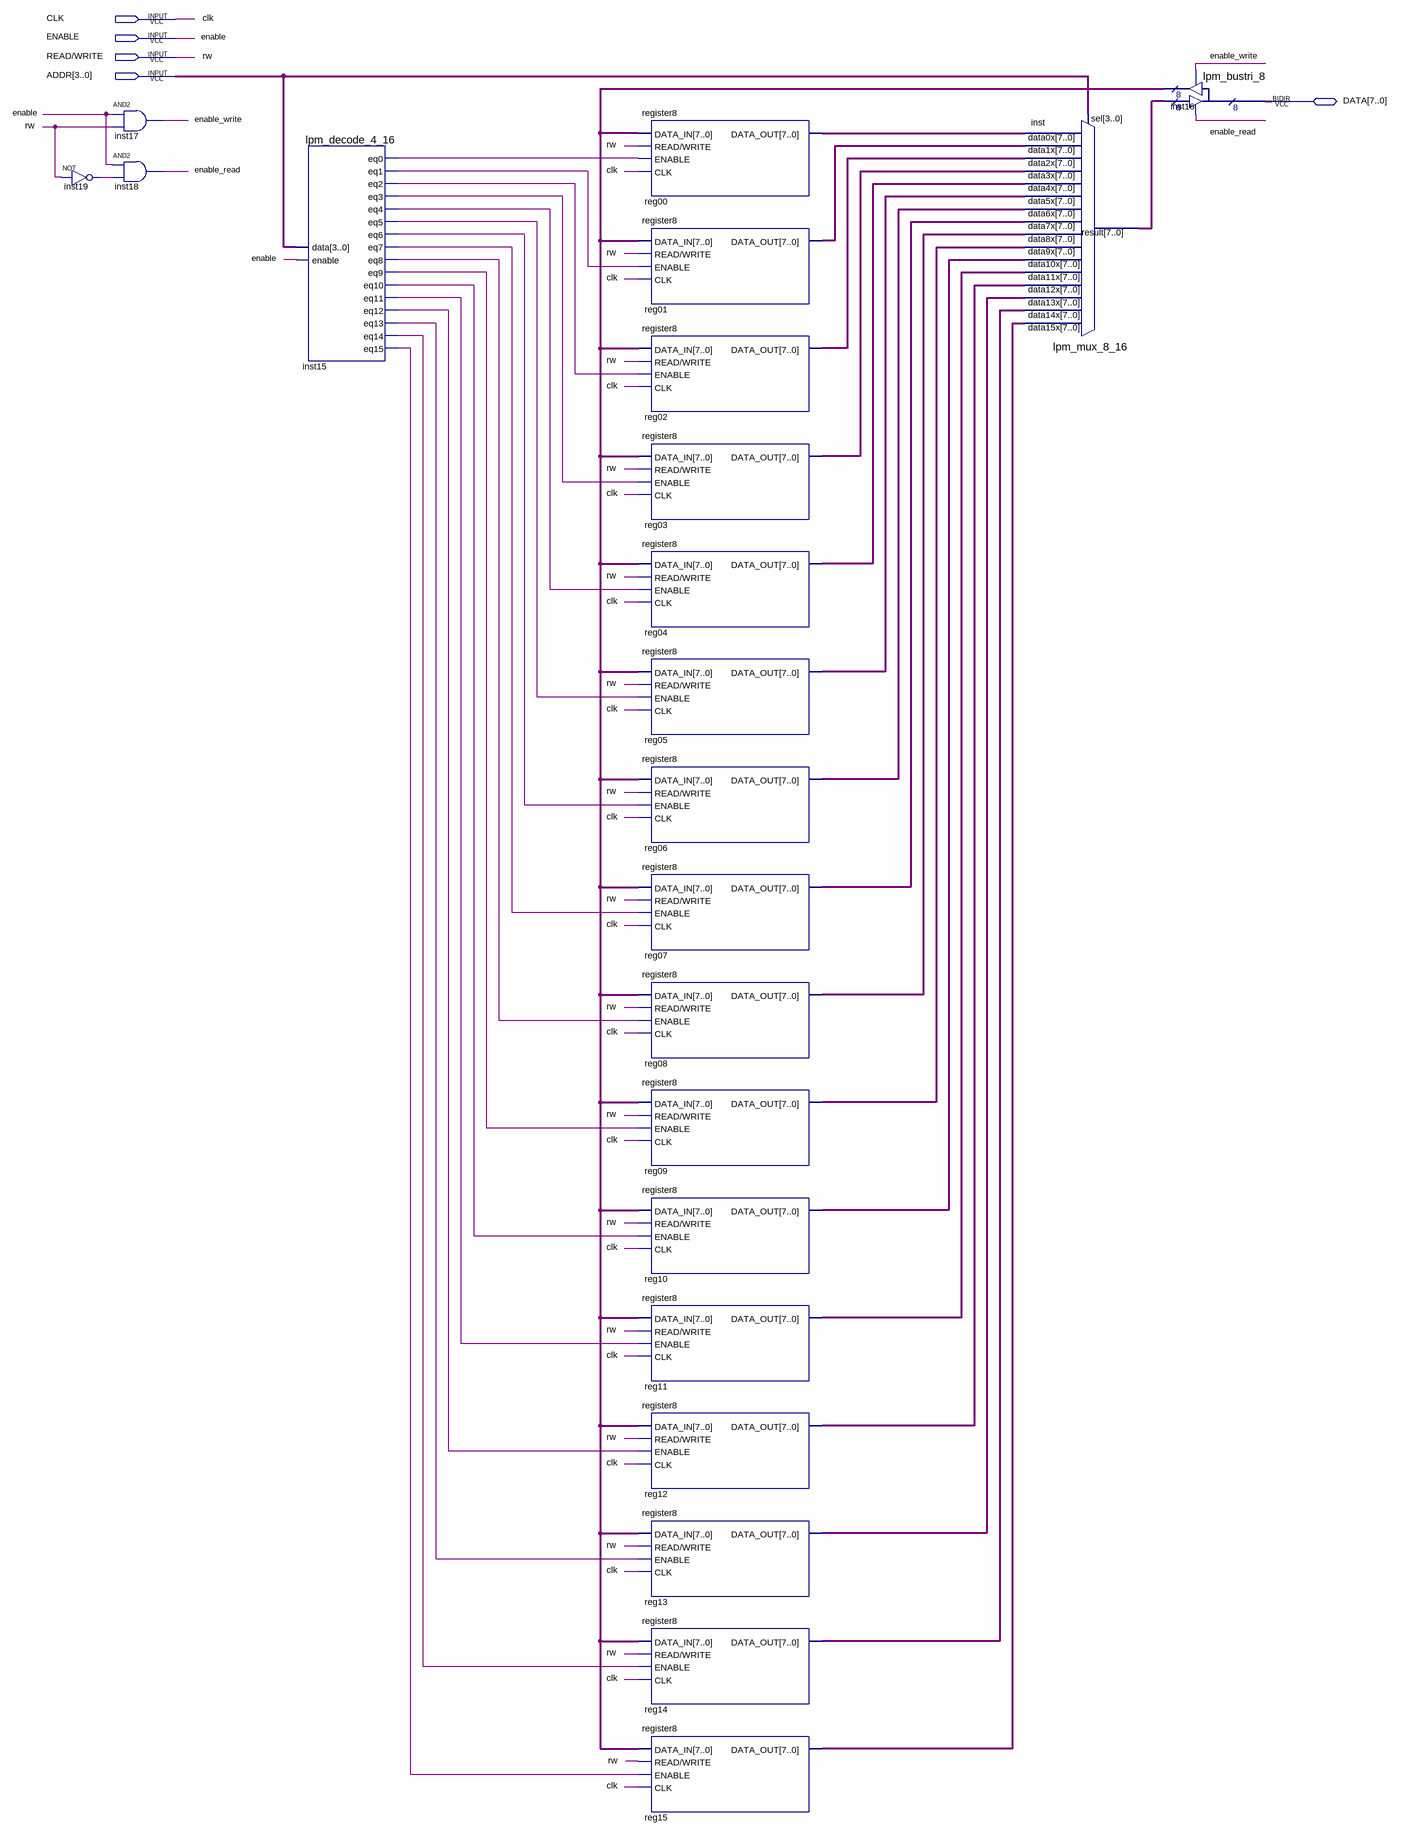
[diagram p0: schematic sheet]
// Quartus schematic register8_block16.bdf as structural Verilog: 22 symbols, 5 pins
module register8_block16 (
  input  CLK,
  input  ENABLE,
  input  \READ/WRITE ,
  input  [3:0] ADDR,
  inout  [7:0] DATA
);

  wire enable_read, enable_write, inst15_eq0, inst15_eq1, inst15_eq2, inst15_eq3, inst15_eq4, inst15_eq5,
       inst15_eq6, inst15_eq7, inst15_eq8, inst15_eq9, inst15_eq10, inst15_eq11, inst15_eq12, inst15_eq13,
       inst15_eq14, inst15_eq15, inst19_out;
  wire [7:0] inst16_result, inst_result, reg00_data_out, reg01_data_out, reg02_data_out, reg03_data_out,
       reg04_data_out, reg05_data_out, reg06_data_out, reg07_data_out, reg08_data_out, reg09_data_out,
       reg10_data_out, reg11_data_out, reg12_data_out, reg13_data_out, reg14_data_out, reg15_data_out;

  not inst19 (inst19_out, \READ/WRITE );
  and inst17 (enable_write, ENABLE, \READ/WRITE );
  and inst18 (enable_read, ENABLE, inst19_out);
  lpm_decode_4_16 inst15 (
    .data(ADDR), .enable(ENABLE), .eq0(inst15_eq0), .eq1(inst15_eq1), .eq2(inst15_eq2), .eq3(inst15_eq3),
    .eq4(inst15_eq4), .eq5(inst15_eq5), .eq6(inst15_eq6), .eq7(inst15_eq7), .eq8(inst15_eq8),
    .eq9(inst15_eq9), .eq10(inst15_eq10), .eq11(inst15_eq11), .eq12(inst15_eq12), .eq13(inst15_eq13),
    .eq14(inst15_eq14), .eq15(inst15_eq15));
  register8 reg00 (
    .DATA_IN(inst16_result), .\READ/WRITE (\READ/WRITE ), .ENABLE(inst15_eq0), .CLK(CLK),
    .DATA_OUT(reg00_data_out));
  register8 reg01 (
    .DATA_IN(inst16_result), .\READ/WRITE (\READ/WRITE ), .ENABLE(inst15_eq1), .CLK(CLK),
    .DATA_OUT(reg01_data_out));
  register8 reg02 (
    .DATA_IN(inst16_result), .\READ/WRITE (\READ/WRITE ), .ENABLE(inst15_eq2), .CLK(CLK),
    .DATA_OUT(reg02_data_out));
  register8 reg03 (
    .DATA_IN(inst16_result), .\READ/WRITE (\READ/WRITE ), .ENABLE(inst15_eq3), .CLK(CLK),
    .DATA_OUT(reg03_data_out));
  register8 reg04 (
    .DATA_IN(inst16_result), .\READ/WRITE (\READ/WRITE ), .ENABLE(inst15_eq4), .CLK(CLK),
    .DATA_OUT(reg04_data_out));
  register8 reg05 (
    .DATA_IN(inst16_result), .\READ/WRITE (\READ/WRITE ), .ENABLE(inst15_eq5), .CLK(CLK),
    .DATA_OUT(reg05_data_out));
  register8 reg06 (
    .DATA_IN(inst16_result), .\READ/WRITE (\READ/WRITE ), .ENABLE(inst15_eq6), .CLK(CLK),
    .DATA_OUT(reg06_data_out));
  register8 reg07 (
    .DATA_IN(inst16_result), .\READ/WRITE (\READ/WRITE ), .ENABLE(inst15_eq7), .CLK(CLK),
    .DATA_OUT(reg07_data_out));
  register8 reg08 (
    .DATA_IN(inst16_result), .\READ/WRITE (\READ/WRITE ), .ENABLE(inst15_eq8), .CLK(CLK),
    .DATA_OUT(reg08_data_out));
  register8 reg09 (
    .DATA_IN(inst16_result), .\READ/WRITE (\READ/WRITE ), .ENABLE(inst15_eq9), .CLK(CLK),
    .DATA_OUT(reg09_data_out));
  register8 reg10 (
    .DATA_IN(inst16_result), .\READ/WRITE (\READ/WRITE ), .ENABLE(inst15_eq10), .CLK(CLK),
    .DATA_OUT(reg10_data_out));
  register8 reg11 (
    .DATA_IN(inst16_result), .\READ/WRITE (\READ/WRITE ), .ENABLE(inst15_eq11), .CLK(CLK),
    .DATA_OUT(reg11_data_out));
  register8 reg12 (
    .DATA_IN(inst16_result), .\READ/WRITE (\READ/WRITE ), .ENABLE(inst15_eq12), .CLK(CLK),
    .DATA_OUT(reg12_data_out));
  register8 reg13 (
    .DATA_IN(inst16_result), .\READ/WRITE (\READ/WRITE ), .ENABLE(inst15_eq13), .CLK(CLK),
    .DATA_OUT(reg13_data_out));
  register8 reg14 (
    .DATA_IN(inst16_result), .\READ/WRITE (\READ/WRITE ), .ENABLE(inst15_eq14), .CLK(CLK),
    .DATA_OUT(reg14_data_out));
  register8 reg15 (
    .DATA_IN(inst16_result), .\READ/WRITE (\READ/WRITE ), .ENABLE(inst15_eq15), .CLK(CLK),
    .DATA_OUT(reg15_data_out));
  lpm_mux_8_16 inst (
    .data15x(reg15_data_out), .data14x(reg14_data_out), .data13x(reg13_data_out), .data12x(reg12_data_out),
    .data11x(reg11_data_out), .data10x(reg10_data_out), .data9x(reg09_data_out), .data8x(reg08_data_out),
    .data7x(reg07_data_out), .data6x(reg06_data_out), .data5x(reg05_data_out), .data4x(reg04_data_out),
    .data3x(reg03_data_out), .data2x(reg02_data_out), .data1x(reg01_data_out), .data0x(reg00_data_out),
    .sel(ADDR), .result(inst_result));
  lpm_bustri_8 inst16 (
    .enabledt(enable_read), .data(inst_result), .enabletr(enable_write), .result(inst16_result),
    .tridata(DATA));

  // Other names for the same wires on the sheet: rw = \READ/WRITE 
endmodule
